# EAGLE schematic E-P-099-R2.5 (EAGLE 7.5.0)
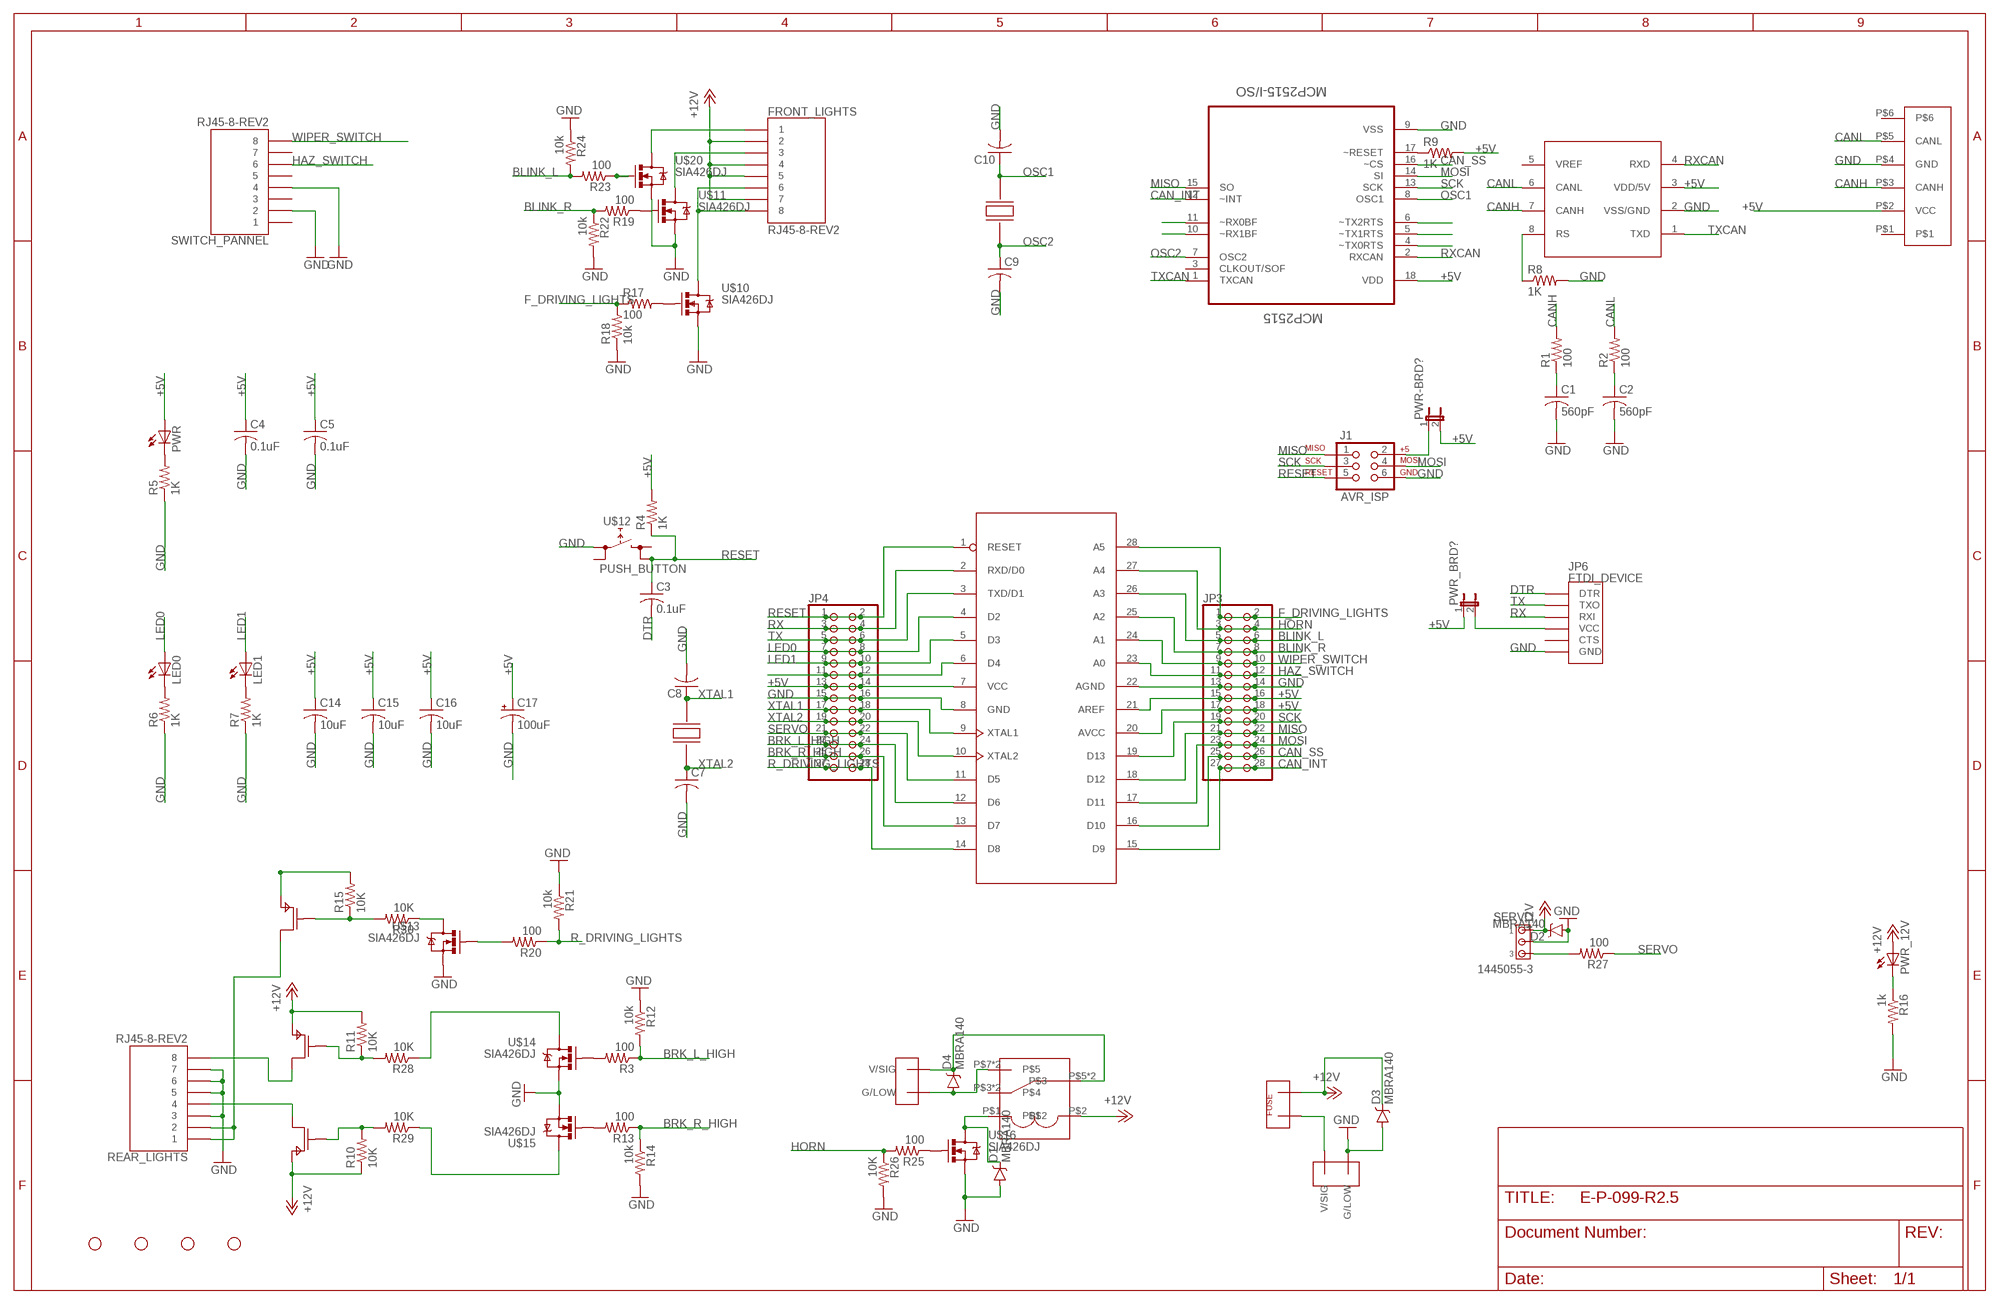
[diagram p0: schematic, sheet 1]

## Parts
C1  560pF  C-USC0805  [C0805]
C2  560pF  C-USC0805  [C0805]
C3  0.1uF  C-USC0805  [C0805]
C4  0.1uF  C-USC0805  [C0805]
C5  0.1uF  C-USC0805  [C0805]
C7  C-USC0805  [C0805]
C8  C-USC0805  [C0805]
C9  C-USC0805  [C0805]
C10  C-USC0805  [C0805]
C14  10uF  C-USC0805  [C0805]
C15  10uF  C-USC0805  [C0805]
C16  10uF  C-USC0805  [C0805]
C17  100uF  47UF-50V-20%(ELECT)  [PANASONIC_D]
CAN-BUS  CAN_6P6C  [CAN_6P6C]
D1  MBRA140  [SMA-DIODE]
D2  MBRA140  [SMA-DIODE]
D3  MBRA140  [SMA-DIODE]
D4  MBRA140  [SMA-DIODE]
FRONT_LIGHTS  RJ45-8-REV2  [RJ45-8]
HORN  TE770966  [2X1-MATE-N-LOCK]
J1  AVR_ISP  AVR_SPI_PRG_6PTH  [2X3]
JP3  PINHD-2X14  [2X14]
JP4  PINHD-2X14  [2X14]
JP6  FTDI_DEVICE  [FTDI_DEVICE_SIDE]
LED0  LED1206  [LED-1206]
LED1  LED1206  [LED-1206]
MCP2515  MCP2515-I/SO  [SOIC127P1034X264-18N]
PWR  LED1206  [LED-1206]
PWR-BRD?  JP1E  [JP1]
PWR_12V  LEDCHIPLED_1206  [CHIPLED_1206]
PWR_BRD?  JP1E  [JP1]
R1  100  R-US_M0805  [M0805]
R2  100  R-US_M0805  [M0805]
R3  100  R-US_M0805  [M0805]
R4  1K  R-US_M0805  [M0805]
R5  1K  R-US_M0805  [M0805]
R6  1K  R-US_M0805  [M0805]
R7  1K  R-US_M0805  [M0805]
R8  1K  R-US_M0805  [M0805]
R9  1K  R-US_M0805  [M0805]
R10  10K  R-US_M0805  [M0805]
R11  10K  R-US_M0805  [M0805]
R12  10k  R-US_M0805  [M0805]
R13  100  R-US_M0805  [M0805]
R14  10k  R-US_M0805  [M0805]
R15  10K  R-US_M0805  [M0805]
R16  1k  R-US_M0805  [M0805]
R17  100  R-US_M0805  [M0805]
R18  10k  R-US_M0805  [M0805]
R19  100  R-US_M0805  [M0805]
R20  100  R-US_M0805  [M0805]
R21  10k  R-US_M0805  [M0805]
R22  10k  R-US_M0805  [M0805]
R23  100  R-US_M0805  [M0805]
R24  10k  R-US_M0805  [M0805]
R25  100  R-US_M0805  [M0805]
R26  10K  R-US_M0805  [M0805]
R27  100  R-US_M0805  [M0805]
R28  10K  R-US_M0805  [M0805]
R29  10K  R-US_M0805  [M0805]
R30  10K  R-US_M0805  [M0805]
REAR_LIGHTS  RJ45-8-REV2  [RJ45-8]
SERVO  1445055-3  [1445055-3]
STANDOFF1  STAND-OFF  [STAND-OFF]
STANDOFF2  STAND-OFF  [STAND-OFF]
STANDOFF3  STAND-OFF  [STAND-OFF]
STANDOFF4  STAND-OFF  [STAND-OFF]
SWITCH_PANNEL  RJ45-8-REV2  [RJ45-8]
U$2  MCP2551DIP  [DIP8]
U$3  SIA449DJ  [SIA449DJ-T1-GE3CT-ND]
U$4  ATMEGA328  [DIP28-0.3IN]
U$5  SIA449DJ  [SIA449DJ-T1-GE3CT-ND]
U$6  SIA449DJ  [SIA449DJ-T1-GE3CT-ND]
U$7  RELAY  [RTD34012]
U$8  TE770966  [2X1-MATE-N-LOCK]
U$9  FUSEMINI-BLADE  [MINI-BLADE-FUSE]
U$10  SIA426DJ  [SC70-6L]
U$11  SIA426DJ  [SC70-6L]
U$12  PUSH_BUTTON  [PUSHBUTTON]
U$13  SIA426DJ  [SC70-6L]
U$14  SIA426DJ  [SC70-6L]
U$15  SIA426DJ  [SC70-6L]
U$16  SIA426DJ  [SC70-6L]
U$18  CRYSTAL  [7A_CRYSTAL]
U$19  CRYSTAL  [7A_CRYSTAL]
U$20  SIA426DJ  [SC70-6L]

## Nets
+5V: C4.1 C5.1 C14.1 C15.1 C16.1 C17.+ CAN-BUS.P$2(VCC) JP3.15 JP3.16 JP3.17 JP3.18 JP4.13 JP4.14 MCP2515.18(VDD) PWR-BRD?.2 PWR.A PWR_BRD?.1 R4.2 R9.2 U$2.3(VDD/5V) U$4.7(VCC) U$4.20(AVCC) U$4.21(AREF)
+12V: D2.C D3.C FRONT_LIGHTS.2 FRONT_LIGHTS.4 FRONT_LIGHTS.5 FRONT_LIGHTS.7 PWR_12V.A R10.1 R11.2 R15.2 SERVO.1 U$3.P$4(P$S) U$3.P$5(P$S) U$5.P$4(P$S) U$5.P$5(P$S) U$6.P$4(P$S) U$6.P$5(P$S) U$7.P$2 U$9.OUT
BLINK_L: JP3.5 JP3.6 R23.2 R24.2 U$4.26(A3)
BLINK_R: JP3.7 JP3.8 R19.2 R22.1 U$4.25(A2)
BRK_L_HIGH: JP4.23 JP4.24 R3.1 R12.2 U$4.12(D6)
BRK_R_HIGH: JP4.25 JP4.26 R13.1 R14.1 U$4.13(D7)
CAN_INT: JP3.27 JP3.28 MCP2515.12(~INT) U$4.15(D9)
CAN_SS: JP3.25 JP3.26 MCP2515.16(~CS) U$4.16(D10)
CANH: CAN-BUS.P$3(CANH) R1.2 U$2.7(CANH)
CANL: CAN-BUS.P$5(CANL) R2.2 U$2.6(CANL)
DTR: C3.2 JP6.P$1(DTR)
F_DRIVING_LIGHTS: JP3.1 JP3.2 R17.1 R18.2 U$4.28(A5)
GND: C1.2 C2.2 C4.2 C5.2 C7.2 C8.2 C9.2 C10.2 C14.2 C15.2 C16.2 C17.- CAN-BUS.P$4(GND) D1.A D2.A D3.A J1.6 JP3.13 JP3.14 JP4.15 JP4.16 JP6.P$6(GND) MCP2515.9(VSS) R5.1 R6.1 R7.1 R8.2 R12.1 R14.2 R16.2 R18.1 R21.1 R22.2 R24.1 R26.2 REAR_LIGHTS.3 REAR_LIGHTS.5 REAR_LIGHTS.6 REAR_LIGHTS.7 SERVO.2 SWITCH_PANNEL.2 SWITCH_PANNEL.4 U$2.2(VSS/GND) U$4.8(GND) U$4.22(AGND) U$8.CIRCUIT2(G/LOW) U$10.S@0(S) U$10.S@1(S) U$11.S@0(S) U$11.S@1(S) U$12.L1(L) U$13.S@0(S) U$13.S@1(S) U$14.S@0(S) U$14.S@1(S) U$15.S@0(S) U$15.S@1(S) U$16.S@0(S) U$16.S@1(S) U$20.S@0(S) U$20.S@1(S)
HAZ_SWITCH: JP3.11 JP3.12 SWITCH_PANNEL.6 U$4.23(A0)
HORN: JP3.3 JP3.4 R25.2 R26.1 U$4.27(A4)
LED0: JP4.7 JP4.8 LED0.A U$4.4(D2)
LED1: JP4.9 JP4.10 LED1.A U$4.5(D3)
MISO: J1.1 JP3.21 JP3.22 MCP2515.15(SO) U$4.18(D12)
MOSI: J1.4 JP3.23 JP3.24 MCP2515.14(SI) U$4.17(D11)
N$1: MCP2515.4(~TX0RTS)
N$2: MCP2515.5(~TX1RTS)
N$3: MCP2515.6(~TX2RTS)
N$4: MCP2515.11(~RX0BF)
N$5: REAR_LIGHTS.4 U$6.P$1(P$D)
N$6: REAR_LIGHTS.8 U$5.P$1(P$D)
N$7: R13.2 U$15.G
N$8: R20.2 U$13.G
N$9: JP6.P$4(VCC) PWR_BRD?.2
N$10: LED0.C R6.2
N$11: LED1.C R7.2
N$12: R8.1 U$2.8(RS)
N$13: REAR_LIGHTS.1 REAR_LIGHTS.2 U$3.P$1(P$D)
N$14: R11.1 R28.2 U$5.P$6(P$G)
N$15: MCP2515.17(~RESET) R9.1
N$16: PWR_12V.C R16.1
N$17: R23.1 U$20.G
N$18: D4.C HORN.CIRCUIT1(V/SIG) U$7.P$5 U$7.P$6
N$19: PWR.C R5.2
N$20: FRONT_LIGHTS.1 U$20.D
N$21: R3.2 U$14.G
N$22: R15.1 R30.2 U$3.P$6(P$G)
N$23: FRONT_LIGHTS.3 U$11.D
N$24: MCP2515.10(~RX1BF)
N$25: C1.1 R1.1
N$26: C2.1 R2.1
N$27: FRONT_LIGHTS.6 FRONT_LIGHTS.8 U$10.D
N$28: D4.A HORN.CIRCUIT2(G/LOW) U$7.P$7 U$7.P$8
N$29: R25.1 U$16.G
N$30: D1.C U$7.P$1 U$16.D
N$32: R10.2 R29.2 U$6.P$6(P$G)
N$33: R19.1 U$11.G
N$34: R30.1 U$13.D
N$35: R17.2 U$10.G
N$36: R27.2 SERVO.3
N$37: J1.2 PWR-BRD?.1
N$38: JP4.11 JP4.12 U$4.6(D4)
N$43: R28.1 U$14.D
N$45: R29.1 U$15.D
N$47: U$8.CIRCUIT1(V/SIG) U$9.IN
OSC1: C10.1 MCP2515.8(OSC1) U$19.P$2
OSC2: C9.1 MCP2515.7(OSC2) U$19.P$1
R_DRIVING_LIGHTS: JP4.27 JP4.28 R20.1 R21.2 U$4.14(D8)
RESET: C3.1 J1.5 JP4.1 JP4.2 R4.1 U$4.1(RESET) U$12.R2(R)
RX: JP4.3 JP4.4 JP6.P$3(RXI) U$4.2(RXD/D0)
RXCAN: MCP2515.2(RXCAN) U$2.4(RXD)
SCK: J1.3 JP3.19 JP3.20 MCP2515.13(SCK) U$4.19(D13)
SERVO: JP4.21 JP4.22 R27.1 U$4.11(D5)
TX: JP4.5 JP4.6 JP6.P$2(TXO) U$4.3(TXD/D1)
TXCAN: MCP2515.1(TXCAN) U$2.1(TXD)
WIPER_SWITCH: JP3.9 JP3.10 SWITCH_PANNEL.8 U$4.24(A1)
XTAL1: C8.1 JP4.17 JP4.18 U$4.9(XTAL1) U$18.P$2
XTAL2: C7.1 JP4.19 JP4.20 U$4.10(XTAL2) U$18.P$1
Unconnected: CAN-BUS.P$1 CAN-BUS.P$6 JP6.P$5(CTS) MCP2515.3(CLKOUT/SOF) SWITCH_PANNEL.1 SWITCH_PANNEL.3 SWITCH_PANNEL.5 SWITCH_PANNEL.7 U$2.5(VREF) U$7.P$3 U$7.P$4 U$12.L2(L) U$12.R1(R)

## Library data of the parts
C1-C5 C7-C10 C14-C16 = adafruit:C-US: CAPACITOR, American symbol
C17 = SparkFun-Capacitors:47UF-50V-20%(ELECT): CAP-10547; PROD_ID: CAP-10547
CAN-BUS = Shell2013:CAN_6P6C: Digikey part: 553-2258-ND
D1-D4 = SparkFun-DiscreteSemi:MBRA140: 40V, 1A Schottky rectifier SMA/DO-214AC package DIO-08053; PROD_ID: DIO-08053
FRONT_LIGHTS REAR_LIGHTS SWITCH_PANNEL = E14-P-099-R21.2(US_drills):RJ45-8-REV2
HORN U$8 = Shell2013(1):TE770966
J1 = E-P-099-R2.2:AVR_SPI_PRG_6: AVR ISP 6 Pin This is the reduced ISP connector for AVR programming. Common on Arduino. This footprint will take up less PCB space and can be used with a 10-pin to 6-pin adapter such as SKU: BOB-08508
JP3 JP4 = E-P-099-R2.2:PINHD-2X14: PIN HEADER
JP6 = SparkFun-Connectors:FTDI_DEVICE: Connector which mates to FTDI basic or FTDI cable.
LED0 LED1 PWR = Shell2013:LED: LEDs Standard schematic elements and footprints for 5mm, 3mm, 1206, and 0603 sized LEDs. 5mm - Spark Fun Electronics SKU : COM-00529 (and others)
MCP2515 = Microchip_By_element14_Batch_1:MCP2515-I/SO: CAN Controller; MPN: MCP2515-I/SO; OC_FARNELL: 1292239; OC_NEWARK: 29H7136; PACKAGE: SOIC-18; SUPPLIER: Microchip
PWR-BRD? PWR_BRD? = E-P-099-R2.2:JP1E: JUMPER
PWR_12V = E14-P-099-R21.2(US_drills):LED: LED OSRAM: - CHIPLED LG R971, LG N971, LY N971, LG Q971, LY Q971, LO R971, LY R971 LH N974, LH R974 LS Q976, LO Q976, LY Q976 LO Q996 - Hyper CHIPLED LW Q18S LB Q993, LB Q99A, LB R99A - SideLED LS A670, LO A670, LY A670, LG A670, LP A670 LB A673, LV A673, LT A673, LW A673 LH A674 LY A675 LS A676, LA A676, LO A676, LY A676, LW A676 LS A679, LY A679, LG A679 - Hyper Micro SIDELED® LS Y876, LA Y876, LO Y876, LY Y876 LT Y87S - SmartLED LW L88C, LW L88S LB L89C, LB L89S, LG L890 LS L89K, LO L89K, LY L89K LS L896, LA L896, LO L896, LY L896 - TOPLED LS T670, LO T670, LY T670, LG T670, LP T670 LSG T670, LSP T670, LSY T670, LOP T670, LYG T670 LG T671, LOG T671, LSG T671 LB T673, LV T673, LT T673, LW T673 LH T674 LS T676, LA T676, LO T676, LY T676, LB T676, LH T676, LSB T676, LW T676 LB T67C, LV T67C, LT T67C, LS T67K, LO T67K, LY T67K, LW E67C LS E67B, LA E67B, LO E67B, LY E67B, LB E67C, LV E67C, LT E67C LW T67C LS T679, LY T679, LG T679 LS T770, LO T770, LY T770, LG T770, LP T770 LB T773, LV T773, LT T773, LW T773 LH T774 LS E675, LA E675, LY E675, LS T675 LS T776, LA T776, LO T776, LY T776, LB T776 LHGB T686 LT T68C, LB T68C - Hyper Mini TOPLED® LB M676 - Mini TOPLED Santana® LG M470 LS M47K, LO M47K, LY M47K Source: http://www.osram.convergy.de LUXEON: - LUMILED® LXK2-PW12-R00, LXK2-PW12-S00, LXK2-PW14-U00, LXK2-PW14-V00 LXK2-PM12-R00, LXK2-PM12-S00, LXK2-PM14-U00 LXK2-PE12-Q00, LXK2-PE12-R00, LXK2-PE12-S00, LXK2-PE14-T00, LXK2-PE14-U00 LXK2-PB12-K00, LXK2-PB12-L00, LXK2-PB12-M00, LXK2-PB14-N00, LXK2-PB14-P00, LXK2-PB14-Q00 LXK2-PR12-L00, LXK2-PR12-M00, LXK2-PR14-Q00, LXK2-PR14-R00 LXK2-PD12-Q00, LXK2-PD12-R00, LXK2-PD12-S00 LXK2-PH12-R00, LXK2-PH12-S00 LXK2-PL12-P00, LXK2-PL12-Q00, LXK2-PL12-R00 Source: www.luxeon.com KINGBRIGHT: KA-3528ASYC Source: www.kingbright.com
R1-R30 = adafruit:R-US_: RESISTOR, American symbol
SERVO = con-amp:1445055-3: Micro MATE-N-LOK Connectors grid 1.5 mm Source: ENG_CD_1445055_A.pdf
STANDOFF1-STANDOFF4 = SparkFun-Electromechanical:STAND-OFF: #4 Stand Off This is the mechanical footprint for a #4 phillips button head screw. Use the keepout ring to avoid running the screw head into surrounding components. SKU : PRT-00447
U$2 = E-P-099-R2.2:MCP2551
U$3 U$5 U$6 = Shell2015:SIA449DJ: 30V 12A P-Mosfet Digikey: SIA449DJ-T1-GE3CT-ND
U$4 = E-P-099-R2.2:ATMEGA328
U$7 = mylibrary:RELAY
U$9 = Shell2013:FUSE
U$10 U$11 U$13-U$16 U$20 = Shell2013:SIA426DJ
U$12 = E-P-099-R2.2:PUSH_BUTTON
U$18 U$19 = mylibrary:CRYSTAL